# Altium schematic sheet Main.SchDoc
size A; SheetNumber: 1; SheetTotal: 4
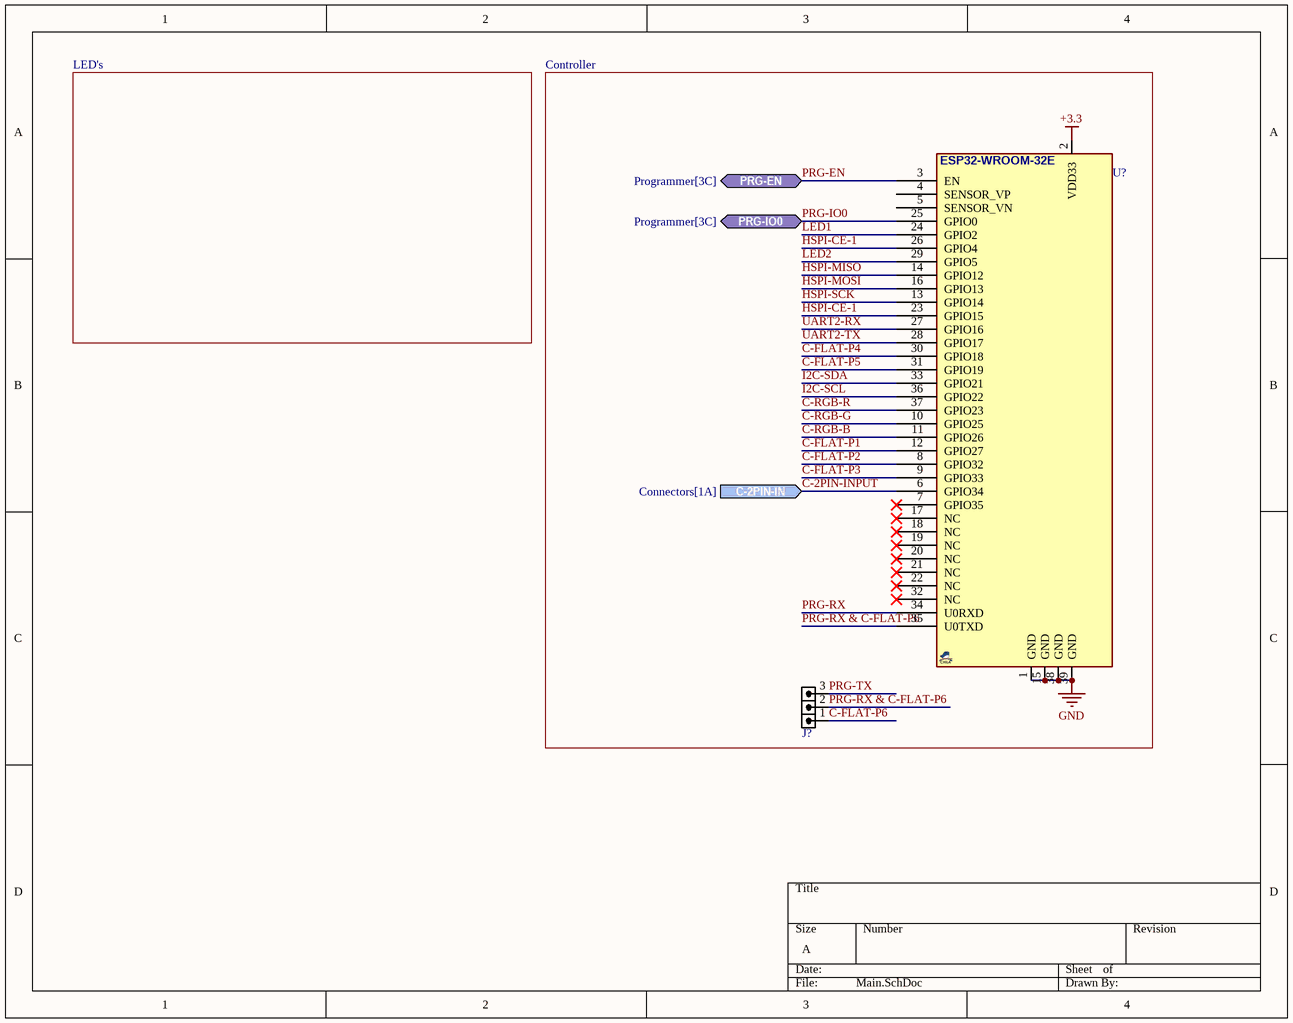
[diagram p0: Main.SchDoc]

## Parts
J?  HDRM3  [HDR_M_1X3]  (value not drawn)
U?  ESP32-WROOM-32E  [ESP32S]  (value not drawn)

## Blocks framed on the sheet
Controller: J? U?

## Ports
C-2PIN-IN (in, see Connectors[1A]), PRG-EN (bidir, see Programmer[3C]), PRG-IO0 (bidir, see Programmer[3C])

## Nets
+3.3: U?.2(VDD33)
GND: U?.1(GND) U?.15(GND) U?.38(GND) U?.39(GND)
C-2PIN-INPUT: U?.6(GPIO34) ; port C-2PIN-IN
C-FLAT-P1: U?.12(GPIO27)
C-FLAT-P2: U?.8(GPIO32)
C-FLAT-P3: U?.9(GPIO33)
C-FLAT-P4: U?.30(GPIO18)
C-FLAT-P5: U?.31(GPIO19)
C-FLAT-P6: J?.1
C-RGB-B: U?.11(GPIO26)
C-RGB-G: U?.10(GPIO25)
C-RGB-R: U?.37(GPIO23)
HSPI-CE-1: U?.23(GPIO15) U?.26(GPIO4)
HSPI-MISO: U?.14(GPIO12)
HSPI-MOSI: U?.16(GPIO13)
HSPI-SCK: U?.13(GPIO14)
I2C-SCL: U?.36(GPIO22)
I2C-SDA: U?.33(GPIO21)
LED1: U?.24(GPIO2)
LED2: U?.29(GPIO5)
PRG-EN: U?.3(EN) ; port PRG-EN
PRG-IO0: U?.25(GPIO0) ; port PRG-IO0
PRG-RX: U?.34(U0RXD)
PRG-RX & C-FLAT-P6: J?.2 U?.35(U0TXD)
PRG-TX: J?.3
UART2-RX: U?.27(GPIO16)
UART2-TX: U?.28(GPIO17)

Not connected (* = marked no-connect by the designer): U? 4(SENSOR_VP) 5(SENSOR_VN) 7(GPIO35)* 17(NC)* 18(NC)* 19(NC)* 20(NC)* 21(NC)* 22(NC)* 32(NC)*

## Notes on the sheet
- LED's

## Library data of the parts
J? = HDR_M_1X3: CONN, HEADER, Male, pitch: 2.54mm, 3POS; VALUE: HDRM3
U? = ESP32-WROOM-32E: WiFi with Bluetooth 4.0; MANF_P#: ESP32-WROOM-32E; VALUE: ESP32-WROOM-32E